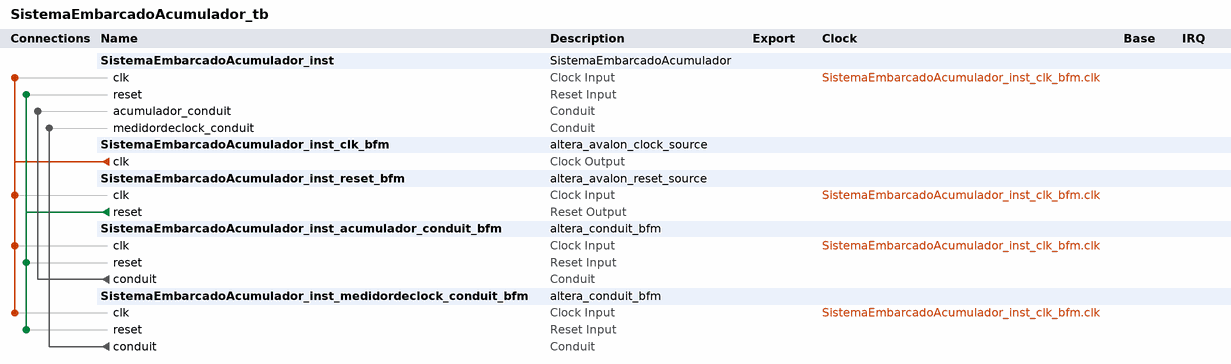
[diagram p0: system contents]
# Platform Designer (Qsys) system SistemaEmbarcadoAcumulador_tb, Cyclone IV E EP4CE115F29C7
# Parameters at their usual value, and those the tool derives, are not listed.
package require -exact qsys 18.1
create_system SistemaEmbarcadoAcumulador_tb
set_project_property DEVICE_FAMILY {Cyclone IV E}
set_project_property DEVICE EP4CE115F29C7

add_instance SistemaEmbarcadoAcumulador_inst SistemaEmbarcadoAcumulador 1.0

add_instance SistemaEmbarcadoAcumulador_inst_clk_bfm altera_avalon_clock_source 18.1

add_instance SistemaEmbarcadoAcumulador_inst_reset_bfm altera_avalon_reset_source 18.1
set_instance_parameter_value SistemaEmbarcadoAcumulador_inst_reset_bfm ASSERT_HIGH_RESET 0
set_instance_parameter_value SistemaEmbarcadoAcumulador_inst_reset_bfm INITIAL_RESET_CYCLES 50

add_instance SistemaEmbarcadoAcumulador_inst_acumulador_conduit_bfm altera_conduit_bfm 18.1
set_instance_parameter_value SistemaEmbarcadoAcumulador_inst_acumulador_conduit_bfm CLOCKED_SIGNAL true
set_instance_parameter_value SistemaEmbarcadoAcumulador_inst_acumulador_conduit_bfm ENABLE_RESET true
set_instance_parameter_value SistemaEmbarcadoAcumulador_inst_acumulador_conduit_bfm SIGNAL_DIRECTIONS input
set_instance_parameter_value SistemaEmbarcadoAcumulador_inst_acumulador_conduit_bfm SIGNAL_ROLES readdata
set_instance_parameter_value SistemaEmbarcadoAcumulador_inst_acumulador_conduit_bfm SIGNAL_WIDTHS 32

add_instance SistemaEmbarcadoAcumulador_inst_medidordeclock_conduit_bfm altera_conduit_bfm 18.1
set_instance_parameter_value SistemaEmbarcadoAcumulador_inst_medidordeclock_conduit_bfm CLOCKED_SIGNAL true
set_instance_parameter_value SistemaEmbarcadoAcumulador_inst_medidordeclock_conduit_bfm ENABLE_RESET true
set_instance_parameter_value SistemaEmbarcadoAcumulador_inst_medidordeclock_conduit_bfm SIGNAL_DIRECTIONS input
set_instance_parameter_value SistemaEmbarcadoAcumulador_inst_medidordeclock_conduit_bfm SIGNAL_ROLES readdata
set_instance_parameter_value SistemaEmbarcadoAcumulador_inst_medidordeclock_conduit_bfm SIGNAL_WIDTHS 32

# connections
add_connection SistemaEmbarcadoAcumulador_inst_clk_bfm.clk SistemaEmbarcadoAcumulador_inst.clk clock
add_connection SistemaEmbarcadoAcumulador_inst_clk_bfm.clk SistemaEmbarcadoAcumulador_inst_acumulador_conduit_bfm.clk clock
add_connection SistemaEmbarcadoAcumulador_inst_clk_bfm.clk SistemaEmbarcadoAcumulador_inst_medidordeclock_conduit_bfm.clk clock
add_connection SistemaEmbarcadoAcumulador_inst_clk_bfm.clk SistemaEmbarcadoAcumulador_inst_reset_bfm.clk clock
add_connection SistemaEmbarcadoAcumulador_inst_reset_bfm.reset SistemaEmbarcadoAcumulador_inst.reset reset
add_connection SistemaEmbarcadoAcumulador_inst_reset_bfm.reset SistemaEmbarcadoAcumulador_inst_acumulador_conduit_bfm.reset reset
add_connection SistemaEmbarcadoAcumulador_inst_reset_bfm.reset SistemaEmbarcadoAcumulador_inst_medidordeclock_conduit_bfm.reset reset
add_connection SistemaEmbarcadoAcumulador_inst_acumulador_conduit_bfm.conduit SistemaEmbarcadoAcumulador_inst.acumulador_conduit conduit
add_connection SistemaEmbarcadoAcumulador_inst_medidordeclock_conduit_bfm.conduit SistemaEmbarcadoAcumulador_inst.medidordeclock_conduit conduit

set_interconnect_requirement {$system} qsys_mm.clockCrossingAdapter HANDSHAKE
set_interconnect_requirement {$system} qsys_mm.enableEccProtection FALSE
set_interconnect_requirement {$system} qsys_mm.insertDefaultSlave FALSE
set_interconnect_requirement {$system} qsys_mm.maxAdditionalLatency 1

save_system SistemaEmbarcadoAcumulador_tb.qsys
